# Altium schematic sheet sb-sonata-fpgapwr.SchDoc: <Enter Sheet Title>
size Letter; Organization: NewAE Technology Inc.; Address1: 1083 Queen St., Suite 196; Address2: Halifax; Address3: NS; Address4: Canada B3H 0B2; SheetNumber: 14; SheetTotal: 22; SheetApproved: YES
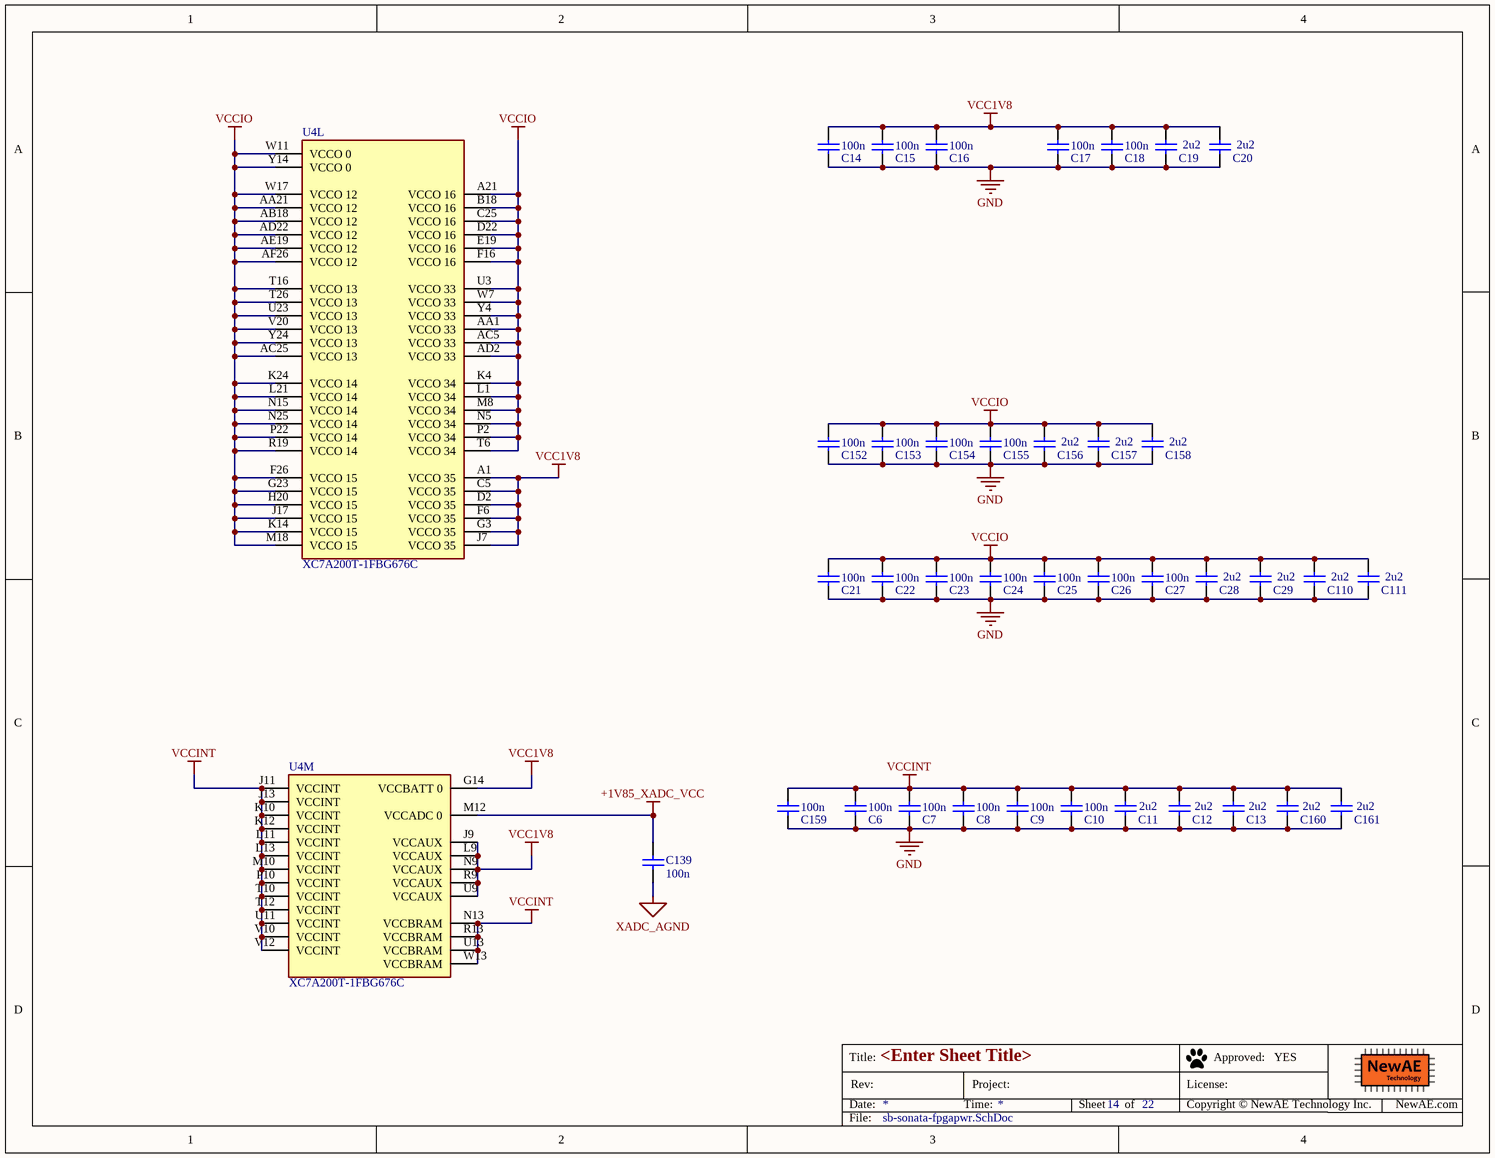
[diagram p0: sb-sonata-fpgapwr.SchDoc]

## Parts
C6  100n  [CAPC0402_M]
C7  100n  [CAPC0402_M]
C8  100n  [CAPC0402_M]
C9  100n  [CAPC0402_M]
C10  100n  [CAPC0402_M]
C11  2u2  [CAPC0603_M]
C12  2u2  [CAPC0603_M]
C13  2u2  [CAPC0603_M]
C14  100n  [CAPC0402_M]
C15  100n  [CAPC0402_M]
C16  100n  [CAPC0402_M]
C17  100n  [CAPC0402_M]
C18  100n  [CAPC0402_M]
C19  2u2  [CAPC0603_M]
C20  2u2  [CAPC0603_M]
C21  100n  [CAPC0402_M]
C22  100n  [CAPC0402_M]
C23  100n  [CAPC0402_M]
C24  100n  [CAPC0402_M]
C25  100n  [CAPC0402_M]
C26  100n  [CAPC0402_M]
C27  100n  [CAPC0402_M]
C28  2u2  [CAPC0603_M]
C29  2u2  [CAPC0603_M]
C110  2u2  [CAPC0603_M]
C111  2u2  [CAPC0603_M]
C139  100n  [CAPC0402_M]
C152  100n  [CAPC0402_M]
C153  100n  [CAPC0402_M]
C154  100n  [CAPC0402_M]
C155  100n  [CAPC0402_M]
C156  2u2  [CAPC0603_M]
C157  2u2  [CAPC0603_M]
C158  2u2  [CAPC0603_M]
C159  100n  [CAPC0402_M]
C160  2u2  [CAPC0603_M]
C161  2u2  [CAPC0603_M]
U4  XC7A200T-1FBG676C  [FP-XC7A200T-1FBG676C-MFG]  (parts L,M of 14)

## Nets
+1V85_XADC_VCC: C139.1 U4.M12(VCCADC_0)
GND: C6.2 C7.2 C8.2 C9.2 C10.2 C11.2 C12.2 C13.2 C14.2 C15.2 C16.2 C17.2 C18.2 C19.2 C20.2 C21.2 C22.2 C23.2 C24.2 C25.2 C26.2 C27.2 C28.2 C29.2 C110.2 C111.2 C152.2 C153.2 C154.2 C155.2 C156.2 C157.2 C158.2 C159.2 C160.2 C161.2
VCC1V8: C14.1 C15.1 C16.1 C17.1 C18.1 C19.1 C20.1 U4.A1(VCCO_35) U4.C5(VCCO_35) U4.D2(VCCO_35) U4.F6(VCCO_35) U4.G3(VCCO_35) U4.G14(VCCBATT_0) U4.J7(VCCO_35) U4.J9(VCCAUX) U4.L9(VCCAUX) U4.N9(VCCAUX) U4.R9(VCCAUX) U4.U9(VCCAUX)
VCCINT: C6.1 C7.1 C8.1 C9.1 C10.1 C11.1 C12.1 C13.1 C159.1 C160.1 C161.1 U4.J11(VCCINT) U4.J13(VCCINT) U4.K10(VCCINT) U4.K12(VCCINT) U4.L11(VCCINT) U4.L13(VCCINT) U4.M10(VCCINT) U4.N13(VCCBRAM) U4.P10(VCCINT) U4.R13(VCCBRAM) U4.T10(VCCINT) U4.T12(VCCINT) U4.U11(VCCINT) U4.U13(VCCBRAM) U4.V10(VCCINT) U4.V12(VCCINT) U4.W13(VCCBRAM)
VCCIO: C21.1 C22.1 C23.1 C24.1 C25.1 C26.1 C27.1 C28.1 C29.1 C110.1 C111.1 C152.1 C153.1 C154.1 C155.1 C156.1 C157.1 C158.1 U4.A21(VCCO_16) U4.AA1(VCCO_33) U4.AA21(VCCO_12) U4.AB18(VCCO_12) U4.AC5(VCCO_33) U4.AC25(VCCO_13) U4.AD2(VCCO_33) U4.AD22(VCCO_12) U4.AE19(VCCO_12) U4.AF26(VCCO_12) U4.B18(VCCO_16) U4.C25(VCCO_16) U4.D22(VCCO_16) U4.E19(VCCO_16) U4.F16(VCCO_16) U4.F26(VCCO_15) U4.G23(VCCO_15) U4.H20(VCCO_15) U4.J17(VCCO_15) U4.K4(VCCO_34) U4.K14(VCCO_15) U4.K24(VCCO_14) U4.L1(VCCO_34) U4.L21(VCCO_14) U4.M8(VCCO_34) U4.M18(VCCO_15) U4.N5(VCCO_34) U4.N15(VCCO_14) U4.N25(VCCO_14) U4.P2(VCCO_34) U4.P22(VCCO_14) U4.R19(VCCO_14) U4.T6(VCCO_34) U4.T16(VCCO_13) U4.T26(VCCO_13) U4.U3(VCCO_33) U4.U23(VCCO_13) U4.V20(VCCO_13) U4.W7(VCCO_33) U4.W11(VCCO_0) U4.W17(VCCO_12) U4.Y4(VCCO_33) U4.Y14(VCCO_0) U4.Y24(VCCO_13)
XADC_AGND: C139.2

## Notes on the sheet
- Title:
- Date:
- Rev:
- Time:
- Project:
- Sheet
- of
- License:
- Copyright © NewAE Technology Inc.
- Approved:
- NewAE.com
- File:

## Library data of the parts
C6-C10 C14-C18 C21-C27 C139 C152-C155 C159 = CCHIP-100n-0402: 100n, 0402; Manufacture Part Number 1: CGA2B3X7R1V104K050BB; Component Group: Capacitor; Case-EIA: 0402; Part Number: CCHIP-100n-0402; Footprint: 0402; Pin Count: 2; Value: 100n; Mounting Technology: SMT; Component Kind: Standard; Component Type: Standard; Supplier 1: Digi-Key; Supplier Part Number 1: 445-6901-1-ND
C11-C13 C19 C20 C28 C29 C110 C111 C156-C158 C160 C161 = CCHIP-2u2-0603: 2u2, 0603; Manufacture 1: Samsung; Manufacture Part Number 1: CL10B225KP8NNNC; Component Group: Capacitor; Case-EIA: 0603; Case-Metric: 1608; Rated Voltage: 10VDC; Part Number: CCHIP-2u2-0603; Footprint: 0603; Pin Count: 2; Supplier 1: Digi-Key; Supplier Part Number 1: 1276-1134-2-ND; Value: 2u2; Mounting Technology: SMT; Component Kind: Standard; Component Type: Standard
U4 = CMP-0364-00015-4: IC FPGA 400 I/O 676FCBGA; Manufacturer: Xilinx; Min Supply Voltage: 0.95V; Number Of Logic Elements Cells: 215360; Ciiva Ids: 8919048; Memory Type: DDR3; Max Supply Voltage: 1.05V; Number Of Registers: 269200; Number Of I/Os: 500; Max Junction Temp: +85°C; Ram Size: 13455360bits; Number Of Logic Blocks: 16825; Standoff Height: 0.4mm; Speed Grade: 1; Import Ts: 1521861070; Memory Size: 1GBytes; Lead Free: Yes; Height: 2.54mm; Octopart: https://octopart.com/xc7a200t-1fbg676c-xilinx-27810760; Ipc Land Pattern Name: BGA676C100P26X26_2700X2700X234; Manufacturer Part Number: XC7A200T-1FBG676C; Package: 0; Device Class L1: Integrated Circuits (ICs); Device Class L3: FPGAs - Field Programmable Gate Arrays; Temperature: 0°C to +85°C; Release Date: 1402465632; Temperature Range High: +85°C; Device Class L2: Embedded Processors and Controllers; RoHS: TRUE; ComponentLink2URL: https://www.xilinx.com/support/documentation/data_sheets/ds181_Artix_7_Data_Sheet.pdf; Temperature Range Low: 0°C; Digikey Description: IC FPGA 400 I/O 676FCBGA; Footprint Url: https://www.xilinx.com/support/documentation/user_guides/ug475_7Series_Pkg_Pinout.pdf; Automotive: No; Category: IC; ComponentLink2Description: Datasheet